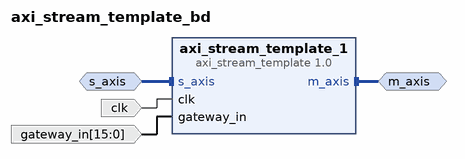
[diagram p0: block diagram of the top level]
# Vivado block design axi_stream_template_bd, xczu28dr-ffvg1517-2-e, Vivado 2024.1
create_bd_design axi_stream_template_bd

create_bd_intf_port -mode Master -vlnv xilinx.com:interface:axis_rtl:1.0 m_axis
create_bd_intf_port -mode Slave -vlnv xilinx.com:interface:axis_rtl:1.0 s_axis
set_property -dict [list \
  CONFIG.HAS_TKEEP 0 \
  CONFIG.HAS_TLAST 1 \
  CONFIG.HAS_TREADY 1 \
  CONFIG.HAS_TSTRB 0 \
  CONFIG.LAYERED_METADATA {['xilinx.com:interface:datatypes:1.0 {', 'TDATA {datatype {name {attribs {resolve_type immediate dependency {} format string minimum {} maximum {}} value {}} bitwidth {attribs {resolve_type immediate dependency {} format long minimum {}', 'maximum {}} value 1} bitoffset {attribs {resolve_type immediate dependency {} format long minimum {} maximum {}} value 0} real {fixed {fractwidth {attribs {resolve_type immediate dependency {} format', 'long minimum {} maximum {}} value 0} signed {attribs {resolve_type immediate dependency {} format bool minimum {} maximum {}} value false}}}}}', '}']} \
  CONFIG.TDATA_NUM_BYTES 0 \
  CONFIG.TDEST_WIDTH 0 \
  CONFIG.TID_WIDTH 0 \
  CONFIG.TUSER_WIDTH 0 \
] [get_bd_intf_ports s_axis]
create_bd_port -dir I -type clk clk
create_bd_port -dir I -from 15 -to 0 -type data gateway_in

create_bd_cell -type ip -vlnv strath.ac.uk:SysGen:axi_stream_template:1.0 axi_stream_template_1

# ---- connections ----

connect_bd_intf_net [get_bd_intf_pins axi_stream_template_1/m_axis] [get_bd_intf_ports m_axis]
connect_bd_intf_net [get_bd_intf_pins axi_stream_template_1/s_axis] [get_bd_intf_ports s_axis]
connect_bd_net [get_bd_ports clk] [get_bd_pins axi_stream_template_1/clk]
connect_bd_net [get_bd_ports gateway_in] [get_bd_pins axi_stream_template_1/gateway_in]

validate_bd_design
save_bd_design
